# EAGLE schematic Schematic Spo2 (1) (EAGLE 9.6.2)
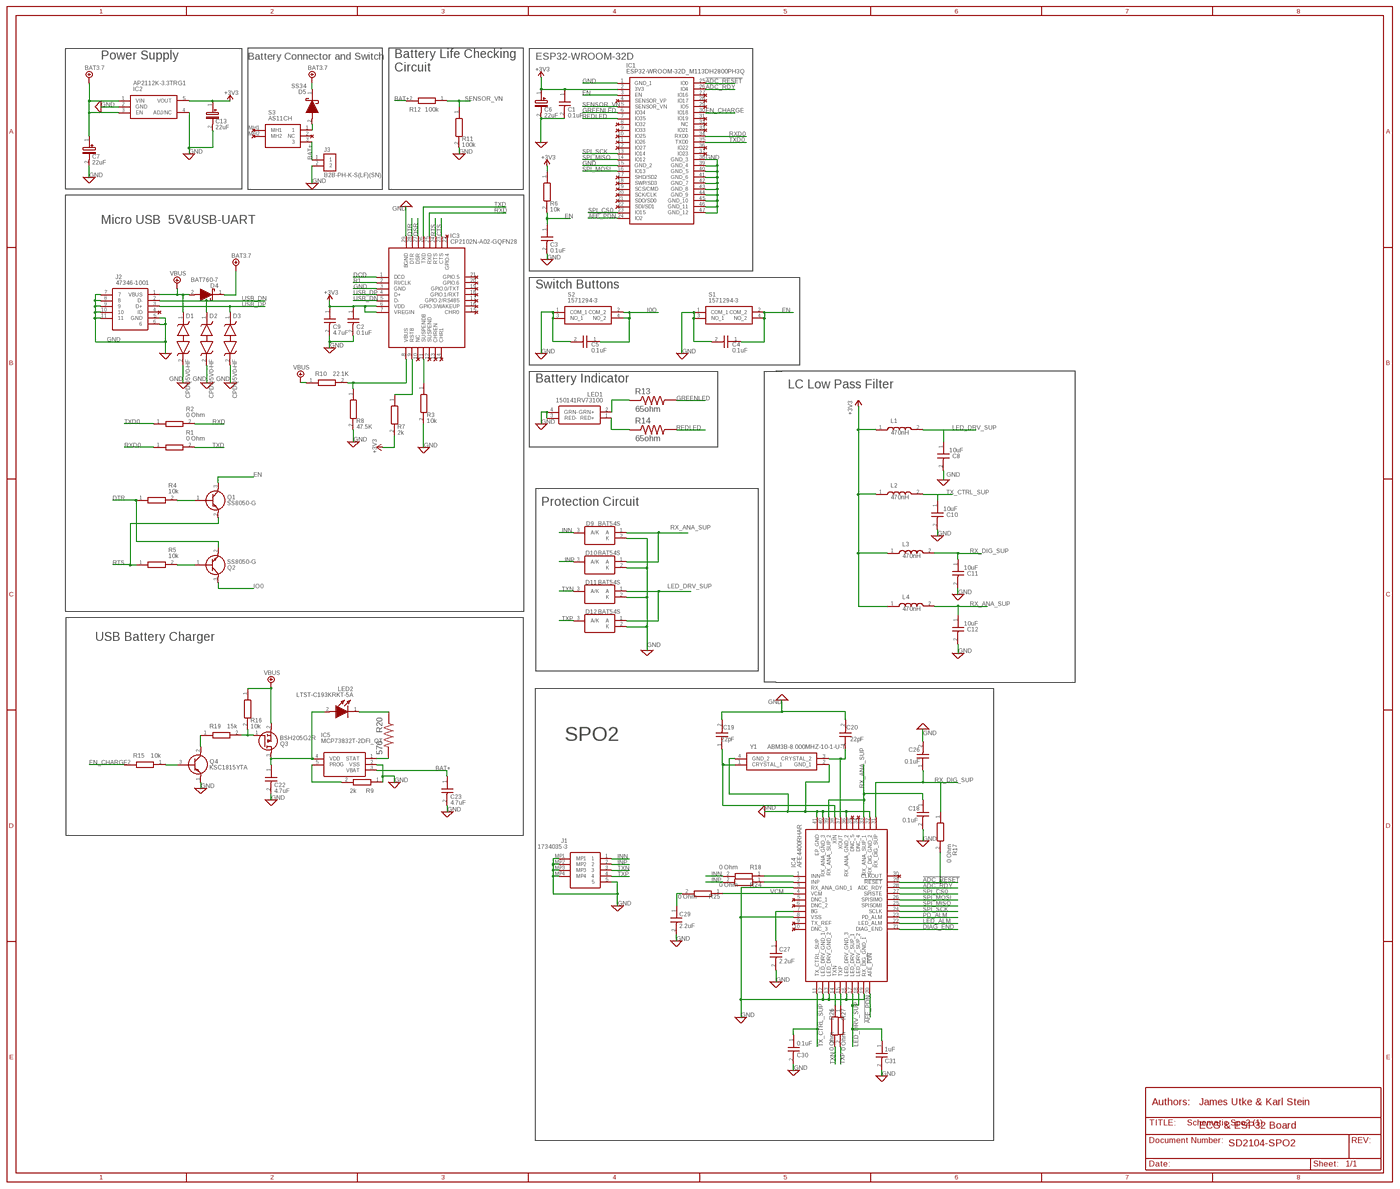
[diagram p0: schematic, sheet 1, overview]
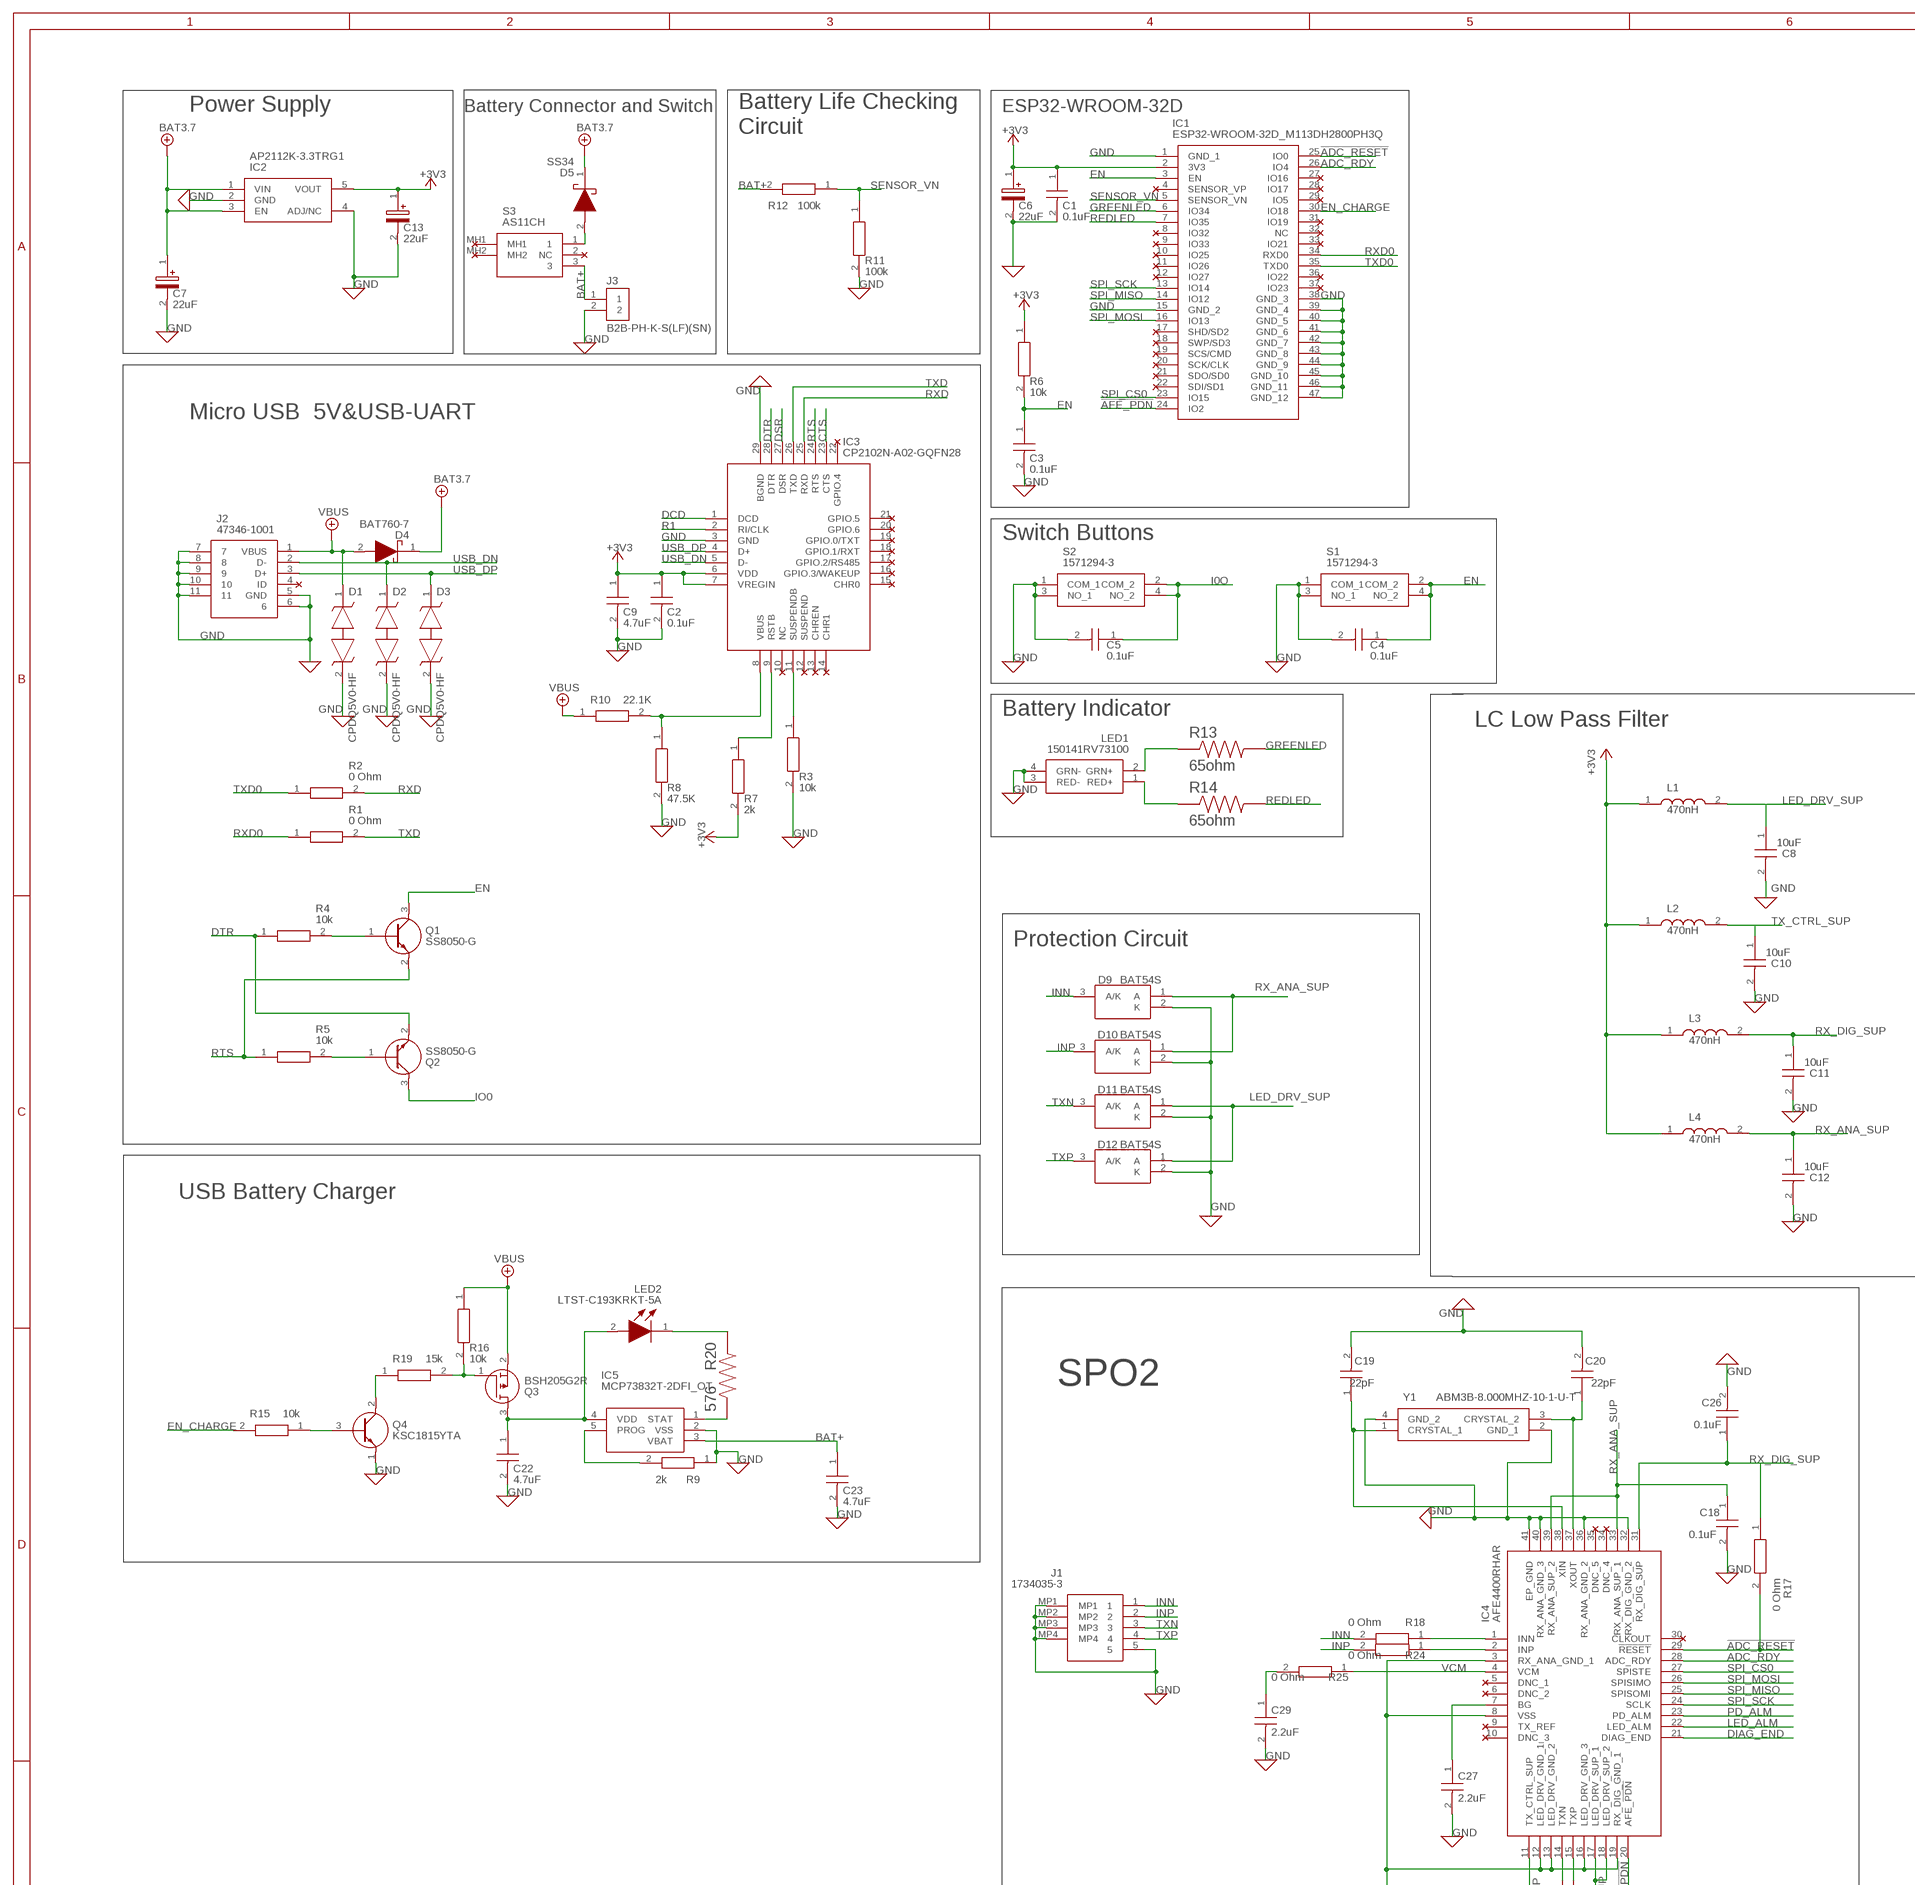
[diagram p1: schematic, sheet 1, part 1 of 4]
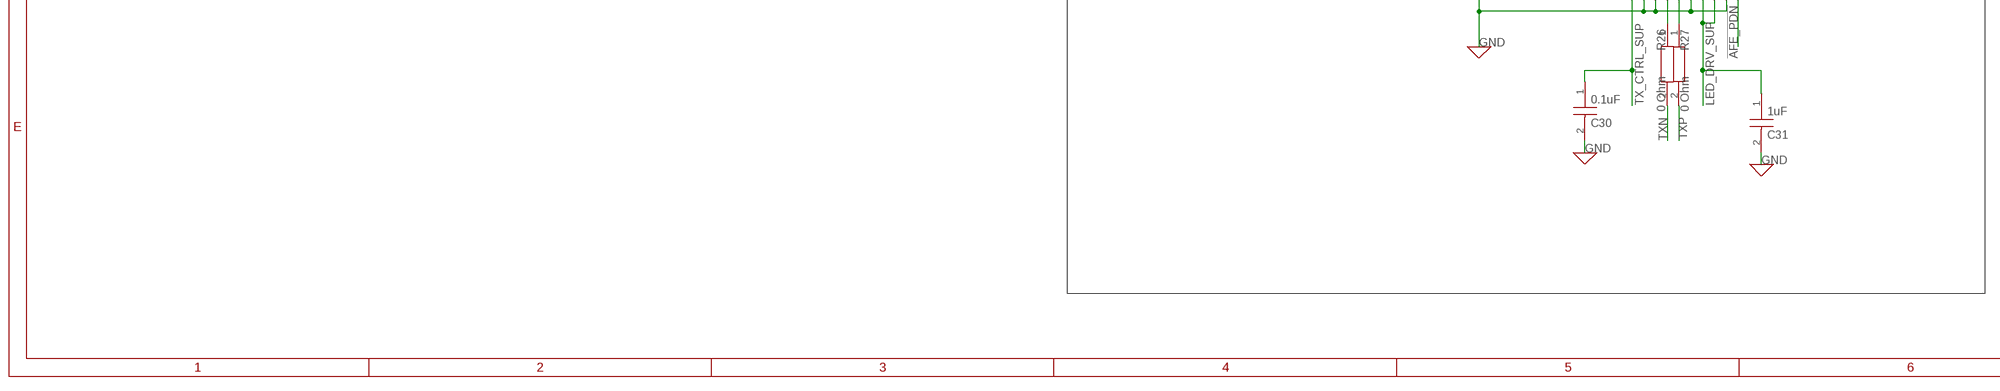
[diagram p2: schematic, sheet 1, part 2 of 4]
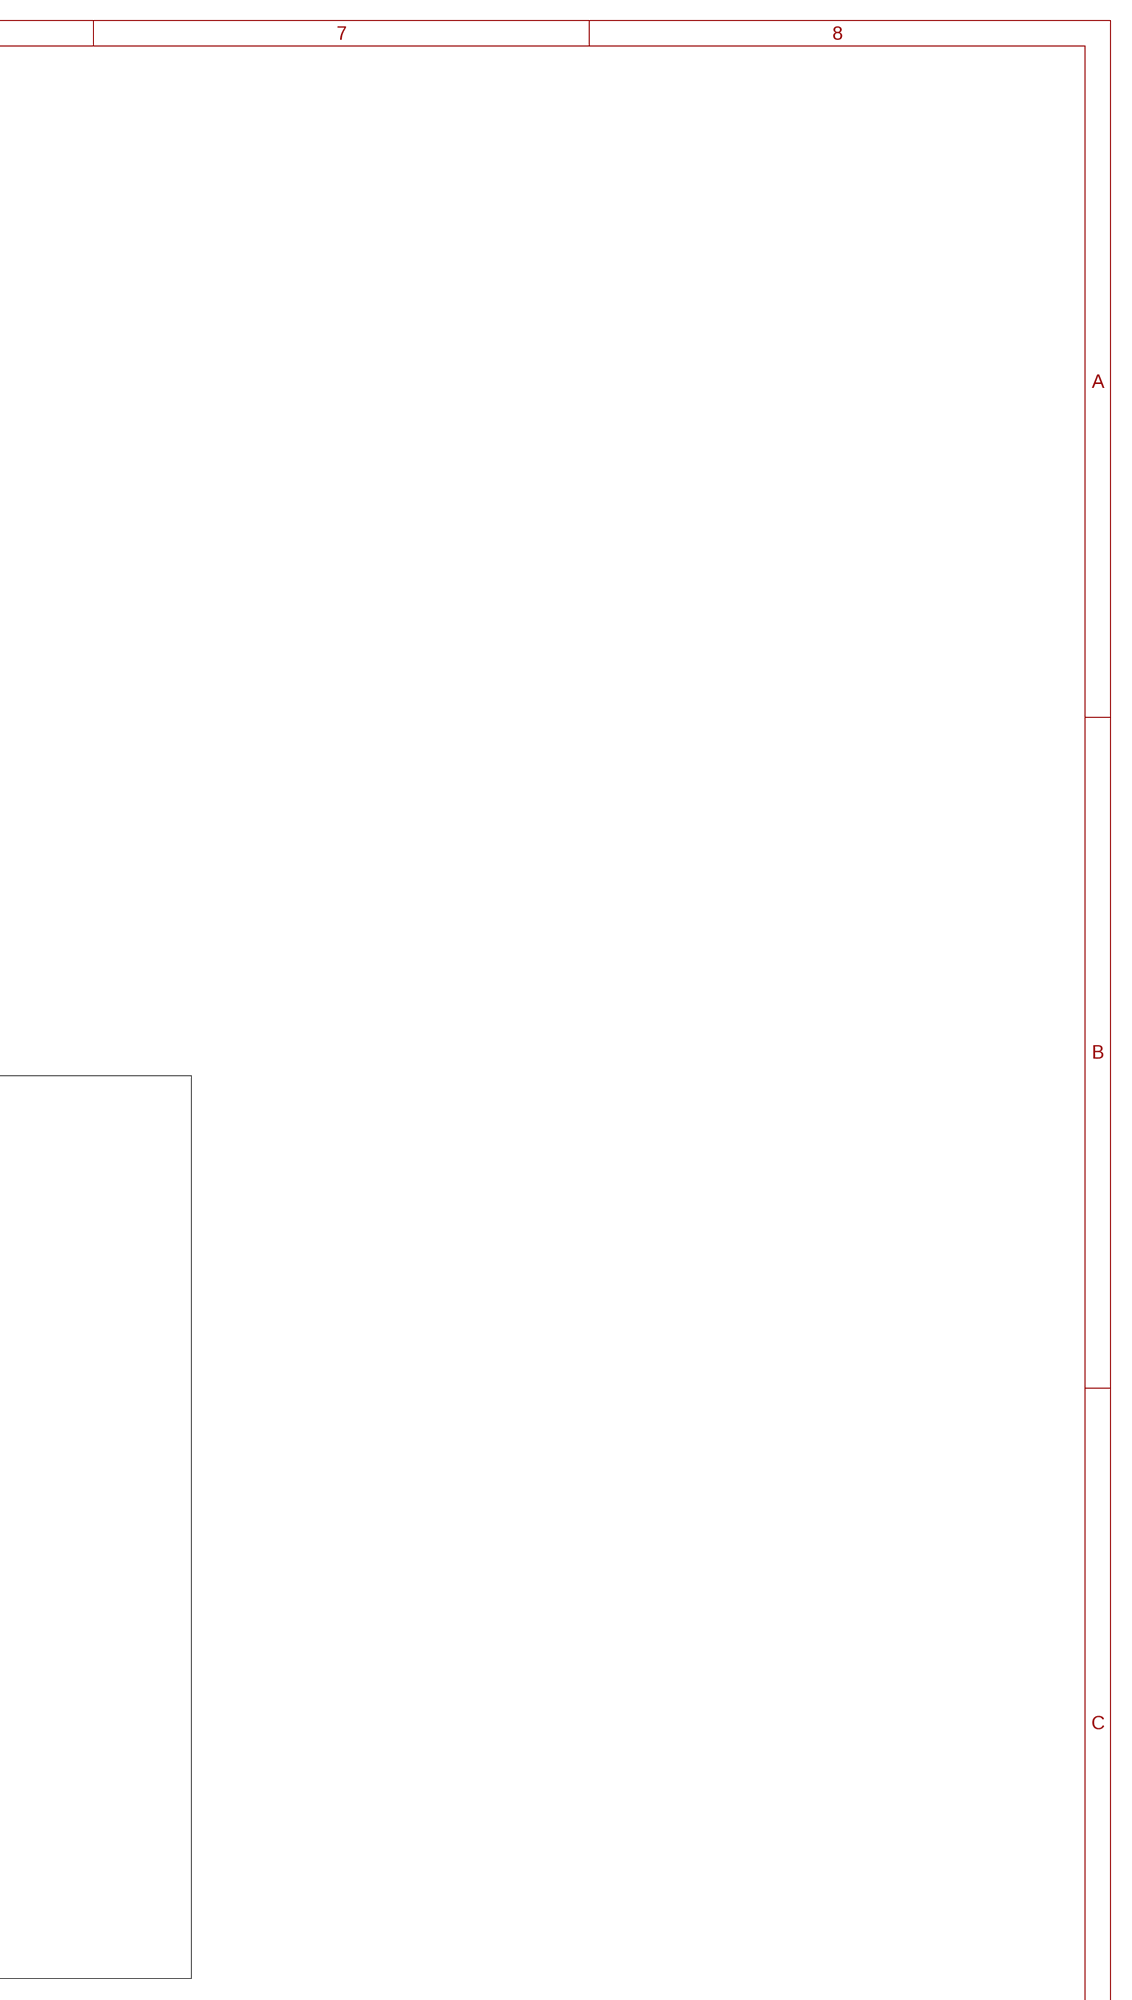
[diagram p3: schematic, sheet 1, part 3 of 4]
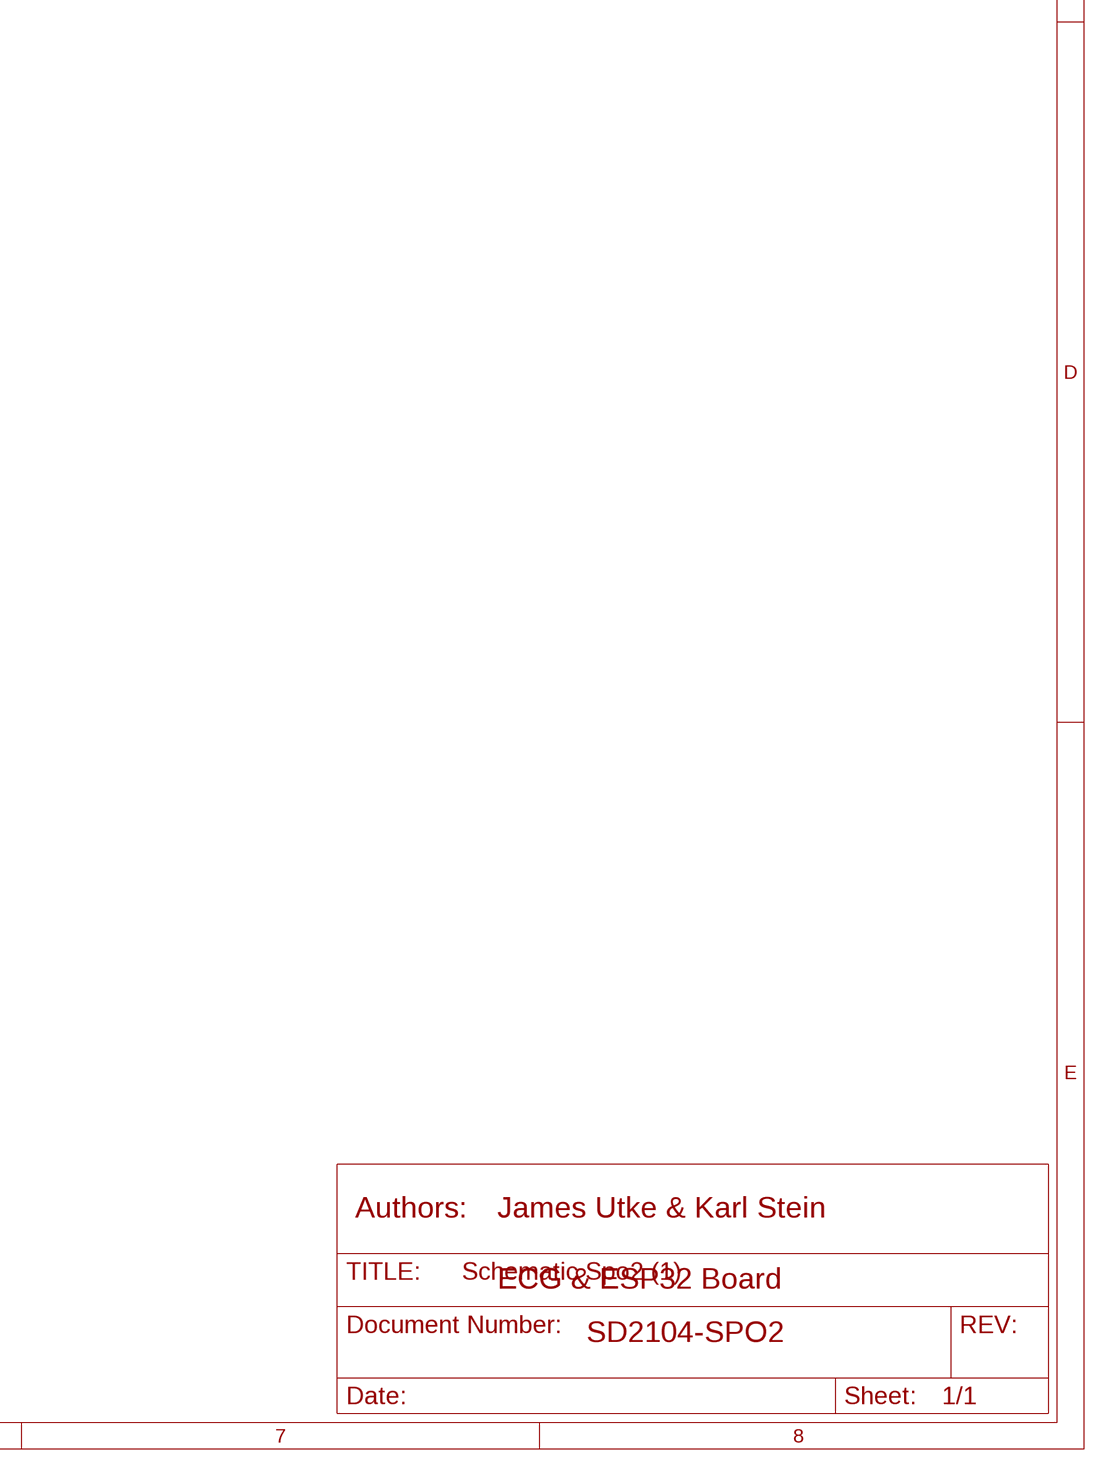
[diagram p4: schematic, sheet 1, part 4 of 4]

## Parts
C1  0.1uF  C0805C104K5RAC7411  [CAPC2012X88N]
C2  0.1uF  C0805C104K5RAC7411  [CAPC2012X88N]
C3  0.1uF  C0805C104K5RAC7411  [CAPC2012X88N]
C4  0.1uF  C0805C104K5RAC7411  [CAPC2012X88N]
C5  0.1uF  C0805C104K5RAC7411  [CAPC2012X88N]
C6  22uF  F381A226MMAAXE  [CAPPC1609X90N]
C7  22uF  F381A226MMAAXE  [CAPPC1609X90N]
C8  10uF  TMK212BC6106KG-T  [CAPC2114X145N@1]
C9  4.7uF  JMK212B7475KGHT  [CAPC2114X145N]
C10  10uF  TMK212BC6106KG-T  [CAPC2114X145N@1]
C11  10uF  TMK212BC6106KG-T  [CAPC2114X145N@1]
C12  10uF  TMK212BC6106KG-T  [CAPC2114X145N@1]
C13  22uF  F381A226MMAAXE  [CAPPC1609X90N]
C18  0.1uF  C0805C104K5RAC7411  [CAPC2012X88N]
C19  22pF  C0805C220K1HACTU  [CAPC2012X88N@1]
C20  22pF  C0805C220K1HACTU  [CAPC2012X88N@1]
C22  4.7uF  JMK212B7475KGHT  [CAPC2114X145N]
C23  4.7uF  JMK212B7475KGHT  [CAPC2114X145N]
C26  0.1uF  C0805C104K5RAC7411  [CAPC2012X88N]
C27  2.2uF  C1608X7S1C225K080AE  [CAPC1608X80N]
C29  2.2uF  C1608X7S1C225K080AE  [CAPC1608X80N]
C30  0.1uF  C0805C104K5RAC7411  [CAPC2012X88N]
C31  1uF  C0805X105K8RAC7210  [CAPC2012X100N]
D1  CPDQ5V0-HF  [SODFL1006X40N]
D2  CPDQ5V0-HF  [SODFL1006X40N]
D3  CPDQ5V0-HF  [SODFL1006X40N]
D4  BAT760-7  [SOD2513X120N]
D5  SS34  [DIOM8059X256N]
D9  BAT54S  [SOT95P240X110-3N]
D10  BAT54S  [SOT95P240X110-3N]
D11  BAT54S  [SOT95P240X110-3N]
D12  BAT54S  [SOT95P240X110-3N]
IC1  ESP32-WROOM-32D_M113DH2800PH3Q  [ESP32WROOM32DM113DH2800PH3Q0]
IC2  AP2112K-3.3TRG1  [SOT95P282X130-5N]
IC3  CP2102N-A02-GQFN28  [QFN50P500X500X80-29N]
IC4  AFE4400RHAR  [QFN50P600X600X100-41N]
IC5  MCP73832T-2DFI_OT  [SOT95P270X145-5N]
J1  1734035-3  [17340353]
J2  47346-1001  [473461001]
J3  B2B-PH-K-S(LF)(SN)  [JST_B2B-PH-K-S(LF)(SN)]
L1  470nH  LPS3010-471MRC  [LPS3010471MRC]
L2  470nH  LPS3010-471MRC  [LPS3010471MRC]
L3  470nH  LPS3010-471MRC  [LPS3010471MRC]
L4  470nH  LPS3010-471MRC  [LPS3010471MRC]
LED1  150141RV73100  [SMD3528_1]
LED2  LTST-C193KRKT-5A  [LEDC1608X45N]
Q1  SS8050-G  [SOT95P240X115-3N]
Q2  SS8050-G  [SOT95P240X115-3N]
Q3  BSH205G2R  [SOT95P230X110-3N]
Q4  KSC1815YTA  [BC33740TA]
R1  0 Ohm  CR0603AJ_-000ELF  [RESC1608X55N]
R2  0 Ohm  CR0603AJ_-000ELF  [RESC1608X55N]
R3  10k  HV73V1JTTD103J  [CAPC1608X55N]
R4  10k  HV73V1JTTD103J  [CAPC1608X55N]
R5  10k  HV73V1JTTD103J  [CAPC1608X55N]
R6  10k  HV73V1JTTD103J  [CAPC1608X55N]
R7  2k  ERJ-UP3F2001V  [RESC1608X55N]
R8  47.5K  ERJ-UP3F4752V  [RESC1608X55N]
R9  2k  ERJ-UP3F2001V  [RESC1608X55N]
R10  22.1K  ERJ-2RHD2212X  [RESC1005X40N]
R11  100k  RCG0603100KJNEA  [RESC1608X50N]
R12  100k  RCG0603100KJNEA  [RESC1608X50N]
R13  65ohm  Y402265R0000A9W  [RESC2012X64N]
R14  65ohm  Y402265R0000A9W  [RESC2012X64N]
R15  10k  HV73V1JTTD103J  [CAPC1608X55N]
R16  10k  HV73V1JTTD103J  [CAPC1608X55N]
R17  0 Ohm  CR0603AJ_-000ELF  [RESC1608X55N]
R18  0 Ohm  CR0603AJ_-000ELF  [RESC1608X55N]
R19  15k  CRCW080515K0FKEBC  [RESC2012X60N]
R20  576  CRCW0805576RFKEA  [RESC2012X50N]
R24  0 Ohm  CR0603AJ_-000ELF  [RESC1608X55N]
R25  0 Ohm  CR0603AJ_-000ELF  [RESC1608X55N]
R26  0 Ohm  CR0603AJ_-000ELF  [RESC1608X55N]
R27  0 Ohm  CR0603AJ_-000ELF  [RESC1608X55N]
S1  1571294-3  [15712943]
S2  1571294-3  [15712943]
S3  AS11CH  [AS11CH]
Y1  ABM3B-8.000MHZ-10-1-U-T  [ABM3B]

## Nets
0: C1.2 C6.2(-) ; supply symbol labelled GND
!ADC_RESET: IC1.25(IO0) IC4.29(!RESET) R17.2
!AFE_PDN: IC1.24(IO2) IC4.20(AFE_!PDN)
+3V3: C1.1 C2.1 C6.1(+) C9.1 C13.1(+) IC1.2(3V3) IC2.5(VOUT) IC3.6(VDD) IC3.7(VREGIN) L1.1 L2.1 L3.1 L4.1 R6.1 R7.2
+5V: C7.1(+) D4.1(K) D5.1(K) IC2.1(VIN) IC2.3(EN) ; supply symbol labelled BAT3.7
+5V/1: D1.1 D4.2(A) J2.1(VBUS) Q3.2(S) R10.1 R16.1 ; supply symbol labelled VBUS
ADC_RDY: IC1.26(IO4) IC4.28(ADC_RDY)
BAT+: C23.1 IC5.3(VBAT) J3.1 R12.2 S3.3
CTS: IC3.23(CTS)
DCD: IC3.1(DCD)
DIAG_END: IC4.21(DIAG_END)
DSR: IC3.27(DSR)
DTR: IC3.28(DTR) Q2.2(E) R4.1
EN: C3.1 C4.1 IC1.3(EN) Q1.3(C) R6.2 S1.2(COM_2) S1.4(NO_2)
EN_CHARGE: IC1.30(IO18) R15.2
GND: C2.2 C3.2 C4.2 C5.2 C7.2(-) C8.2 C9.2 C10.2 C11.2 C12.2 C13.2(-) C18.2 C19.2 C20.2 C22.2 C23.2 C26.2 C27.2 C29.2 C30.2 C31.2 D1.2 D2.2 D3.2 D9.2(K) D10.2(K) D11.2(K) D12.2(K) IC1.1(GND_1) IC1.15(GND_2) IC1.38(GND_3) IC1.39(GND_4) IC1.40(GND_5) IC1.41(GND_6) IC1.42(GND_7) IC1.43(GND_8) IC1.44(GND_9) IC1.45(GND_10) IC1.46(GND_11) IC1.47(GND_12) IC2.2(GND) IC2.4(ADJ/NC) IC3.3(GND) IC3.29(BGND) IC4.3(RX_ANA_GND_1) IC4.8(VSS) IC4.12(LED_DRV_GND_1) IC4.13(LED_DRV_GND_2) IC4.16(LED_DRV_GND_3) IC4.19(RX_DIG_GND_1) IC4.32(RX_DIG_GND_2) IC4.36(RX_ANA_GND_2) IC4.40(RX_ANA_GND_3) IC4.41(EP_GND) IC5.2(VSS) J1.5 J1.MP1 J1.MP2 J1.MP3 J1.MP4 J2.5(GND) J2.6 J2.7 J2.8 J2.9 J2.10 J2.11 J3.2 LED1.3(RED-) LED1.4(GRN-) Q4.1(E) R3.2 R8.2 R9.1 R11.2 S1.1(COM_1) S1.3(NO_1) S2.1(COM_1) S2.3(NO_1) Y1.2(GND_1) Y1.4(GND_2)
GREENLED: IC1.6(IO34) R13.2
I0O: C5.1 S2.2(COM_2) S2.4(NO_2)
INN: D9.3(A/K) J1.1 R18.2
INP: D10.3(A/K) J1.2 R24.2
IO0: Q2.3(C)
LED_ALM: IC4.22(LED_ALM)
LED_DRV_SUP: C8.1 C31.1 D11.1(A) D12.1(A) IC4.17(LED_DRV_SUP_1) IC4.18(LED_DRV_SUP_2) L1.2
N$1: LED1.2(GRN+) R13.1
N$2: LED1.1(RED+) R14.1
N$3: C19.1 IC4.38(XIN) Y1.1(CRYSTAL_1)
N$4: Q1.1(B) R4.2
N$5: Q2.1(B) R5.2
N$6: IC5.5(PROG) R9.2
N$7: C20.1 IC4.37(XOUT) Y1.3(CRYSTAL_2)
N$8: C27.1 IC4.7(BG)
N$9: IC4.1(INN) R18.1
N$10: IC4.2(INP) R24.1
N$11: IC4.14(TXN) R26.1
N$12: C29.1 R25.2
N$13: IC4.15(TXP) R27.1
N$14: Q4.3(B) R15.1
N$15: Q4.2(C) R19.1
N$16: IC3.11(SUSPENDB) R3.1
N$17: IC3.9(RSTB) R7.1
N$18: IC3.8(VBUS) R8.1 R10.2
N$19: LED2.1(K) R20.1
N$20: D5.2(A) S3.1
N$25: Q3.1(G) R16.2 R19.2
N$26: IC5.1(STAT) R20.2
N$28: C22.1 IC5.4(VDD) LED2.2(A) Q3.3(D)
PD_ALM: IC4.23(PD_ALM)
R1: IC3.2(RI/CLK)
REDLED: IC1.7(IO35) R14.2
RTS: IC3.24(RTS) Q1.2(E) R5.1
RX_ANA_SUP: C12.1 C18.1 D9.1(A) D10.1(A) IC4.33(RX_ANA_SUP_1) IC4.39(RX_ANA_SUP_2) L4.2
RX_DIG_SUP: C11.1 C26.1 IC4.31(RX_DIG_SUP) L3.2 R17.1
RXD: IC3.25(RXD) R2.2
RXD0: IC1.34(RXD0) R1.1
SENSOR_VN: IC1.5(SENSOR_VN) R11.1 R12.1
SPI_CS0: IC1.23(IO15) IC4.27(SPISTE)
SPI_MISO: IC1.14(IO12) IC4.25(SPISOMI)
SPI_MOSI: IC1.16(IO13) IC4.26(SPISIMO)
SPI_SCK: IC1.13(IO14) IC4.24(SCLK)
TX_CTRL_SUP: C10.1 C30.1 IC4.11(TX_CTRL_SUP) L2.2
TXD: IC3.26(TXD) R1.2
TXD0: IC1.35(TXD0) R2.1
TXN: D11.3(A/K) J1.3 R26.2
TXP: D12.3(A/K) J1.4 R27.2
USB_DN: D2.1 IC3.5(D-) J2.2(D-)
USB_DP: D3.1 IC3.4(D+) J2.3(D+)
VCM: IC4.4(VCM) R25.1
Unconnected: IC1.4(SENSOR_VP) IC1.8(IO32) IC1.9(IO33) IC1.10(IO25) IC1.11(IO26) IC1.12(IO27) IC1.17(SHD/SD2) IC1.18(SWP/SD3) IC1.19(SCS/CMD) IC1.20(SCK/CLK) IC1.21(SDO/SD0) IC1.22(SDI/SD1) IC1.27(IO16) IC1.28(IO17) IC1.29(IO5) IC1.31(IO19) IC1.32(NC) IC1.33(IO21) IC1.36(IO22) IC1.37(IO23) IC3.10(NC) IC3.12(SUSPEND) IC3.13(CHREN) IC3.14(CHR1) IC3.15(CHR0) IC3.16(GPIO.3/WAKEUP) IC3.17(GPIO.2/RS485) IC3.18(GPIO.1/RXT) IC3.19(GPIO.0/TXT) IC3.20(GPIO.6) IC3.21(GPIO.5) IC3.22(GPIO.4) IC4.5(DNC_1) IC4.6(DNC_2) IC4.9(TX_REF) IC4.10(DNC_3) IC4.30(CLKOUT) IC4.34(DNC_4) IC4.35(DNC_5) J2.4(ID) S3.2(NC) S3.MH1 S3.MH2

## Notes on the sheet
- Power Supply | Battery Connector and Switch | ESP32-WROOM-32D
- Battery Life Checking 
  Circuit
- Micro USB  5V&USB-UART
- Switch Buttons
- Battery Indicator
- LC Low Pass Filter
- Protection Circuit
- USB Battery Charger
- SPO2
- Authors: | James Utke & Karl Stein
- ECG & ESP32 Board
- SD2104-SPO2

## Library data of the parts
C1-C5 C18 C26 C30 = SamacSys_Parts:C0805C104K5RAC7411: Cap Ceramic 0.1uF 50V X7R 10% Pad SMD 0805 125C T/R Source: Datasheet; DESCRIPTION: Cap Ceramic 0.1uF 50V X7R 10% Pad SMD 0805 125C T/R; HEIGHT: 0.88mm; MANUFACTURER_NAME: Kemet; MANUFACTURER_PART_NUMBER: C0805C104K5RAC7411; MOUSER_PART_NUMBER: 80-C0805C104K5RACLR; MOUSER_PRICE-STOCK: https://www.mouser.co.uk/ProductDetail/KEMET/C0805C104K5RAC7411/?qs=jbRM9o5BbzPcVXF0wW9AYg%3D%3D
C6 C7 C13 = SamacSys_Parts:F381A226MMAAXE: 22uF F38 Series Conductive Polymer, Miniature, Undertab Solid Electrolytic Chip Capacitors Source: Datasheet <https://componentsearchengine.com/Datasheets/1/F381A226MMAAXE.pdf>; DESCRIPTION: 22uF F38 Series Conductive Polymer, Miniature, Undertab Solid Electrolytic Chip Capacitors; HEIGHT: 0.9mm; MANUFACTURER_NAME: AVX; MANUFACTURER_PART_NUMBER: F381A226MMAAXE; MOUSER_PART_NUMBER: 581-F381A226MMAAXE; MOUSER_PRICE-STOCK: https://www.mouser.co.uk/ProductDetail/AVX/F381A226MMAAXE?qs=gTYE2QTfZfQFi8JvXKXiKg%3D%3D
C8 C10-C12 = SamacSys_Parts:TMK212BC6106KG-T: Status Mass Production (Preferred) Capacitance 10 uF +/- 10 % Case Size (EIA/JIS) 0805/2012 Rated Voltage 25 V tan (max) 10 % Temperature Characteristic (EIA) X6S Operating Temp. Range (EIA) -55 to +105 High Temperature Loading (% Rated Voltage) 150 % Insulation Resistance (min) 100 MuF Dimension L 2.0 +0.20/-0.00 mm Dimension W 1.25 +0.20/-0.00 mm Dimension T 1.25 +0.20/-0.00 mm Dimension e 0.50 +/-0.25 mm RoHS Compliance (10 subst.) Yes REACH Compliance (205 subst.) Yes IEC62474 (Ver. D19 Source: Datasheet <https://ds.yuden.co.jp/TYCOMPAS/ut/download?pn=LMK063BBJ474MPLF&fileType=CA>; DESCRIPTION: Status Mass Production (Preferred) Capacitance 10 uF +/- 10 % Case Size (EIA/JIS) 0805/2012 Rated Voltage 25 V tan (max) 10 % Temperature Characteristic (EIA) X6S Operating Temp. Range (EIA) -55 to +105 High Temperature Loading (% Rated Voltage) 150 % Insulation Resistance (min) 100 MuF Dimension L 2.0 +0.20/-0.00 mm Dimension W 1.25 +0.20/-0.00 mm Dimension T 1.25 +0.20/-0.00 mm Dimension e 0.50 +/-0.25 mm RoHS Compliance (10 subst.) Yes REACH Compliance (205 subst.) Yes IEC62474 (Ver. D19; HEIGHT: 1.45mm; MANUFACTURER_NAME: TAIYO YUDEN; MANUFACTURER_PART_NUMBER: TMK212BC6106KG-T; MOUSER_PART_NUMBER: 963-TMK212BC6106KG-T; MOUSER_PRICE-STOCK: https://www.mouser.co.uk/ProductDetail/Taiyo-Yuden/TMK212BC6106KG-T/?qs=rI7uf1IzohRW7kV5WJ6mlg%3D%3D
C9 C22 C23 = SamacSys_Parts:JMK212B7475KGHT: Taiyo Yuden JMK212B7475KGHT 4.7F MLCC 6.3V dc +/-10% Tolerance SMD Source: Datasheet; DESCRIPTION: Taiyo Yuden JMK212B7475KGHT 4.7F MLCC 6.3V dc +/-10% Tolerance SMD; HEIGHT: 1.45mm; MANUFACTURER_NAME: TAIYO YUDEN; MANUFACTURER_PART_NUMBER: JMK212B7475KGHT; MOUSER_PART_NUMBER: 963-JMK212B7475KGHT; MOUSER_PRICE-STOCK: https://www.mouser.co.uk/ProductDetail/Taiyo-Yuden/JMK212B7475KGHT/?qs=vmHwEFxEFR9NgetR%2FORAvw%3D%3D
C19 C20 = SamacSys_Parts:C0805C220K1HACTU: Multilayer Ceramic Capacitors MLCC - SMD/SMT 100V 22pF X8R 0805 10% Source: Datasheet; DESCRIPTION: Multilayer Ceramic Capacitors MLCC - SMD/SMT 100V 22pF X8R 0805 10%; HEIGHT: 0.88mm; MANUFACTURER_NAME: Kemet; MANUFACTURER_PART_NUMBER: C0805C220K1HACTU; MOUSER_PART_NUMBER: 80-C0805C220K1HACTU; MOUSER_PRICE-STOCK: https://www.mouser.co.uk/ProductDetail/KEMET/C0805C220K1HACTU/?qs=W0yvOO0ixfHaPTgNXyVDyQ%3D%3D
C27 C29 = SamacSys_Parts:C1608X7S1C225K080AE: Multilayer Ceramic Capacitors MLCC - SMD/SMT 0603 16VDC 2.2uF 10% X7S Source: Datasheet <https://product.tdk.com/info/en/catalog/datasheets/mlcc_commercial_midvoltage_en.pdf>; DESCRIPTION: Multilayer Ceramic Capacitors MLCC - SMD/SMT 0603 16VDC 2.2uF 10% X7S; HEIGHT: 0.8mm; MANUFACTURER_NAME: TDK; MANUFACTURER_PART_NUMBER: C1608X7S1C225K080AE; MOUSER_PART_NUMBER: 810-C1608X7S1C225K08; MOUSER_PRICE-STOCK: https://www.mouser.co.uk/ProductDetail/TDK/C1608X7S1C225K080AE/?qs=zW32dvEIR3tqedNHz865EA%3D%3D
C31 = SamacSys_Parts:C0805X105K8RAC7210: Multilayer Ceramic Capacitors MLCC - SMD/SMT 10V 1uF X7R 0805 10% Flex Source: Datasheet; DESCRIPTION: Multilayer Ceramic Capacitors MLCC - SMD/SMT 10V 1uF X7R 0805 10% Flex; HEIGHT: 1mm; MANUFACTURER_NAME: Kemet; MANUFACTURER_PART_NUMBER: C0805X105K8RAC7210; MOUSER_PART_NUMBER: 80-C0805X105K8RACLR; MOUSER_PRICE-STOCK: https://www.mouser.co.uk/ProductDetail/KEMET/C0805X105K8RAC7210?qs=ds50AKTGxA8Ac4j4qbsB5A%3D%3D
D1-D3 = SamacSys_Parts:CPDQ5V0-HF: ESD Suppressors / TVS Diodes SMD ESD Diode 5V Bi-Direction Source: Datasheet <http://www.comchiptech.com/cms/UserFiles/CPDQ5V0-HF RevA825126.pdf>; DESCRIPTION: ESD Suppressors / TVS Diodes SMD ESD Diode 5V Bi-Direction; HEIGHT: 0.4mm; MANUFACTURER_NAME: Comchip Technology; MANUFACTURER_PART_NUMBER: CPDQ5V0-HF; MOUSER_PART_NUMBER: 750-CPDQ5V0-HF; MOUSER_PRICE-STOCK: https://www.mouser.co.uk/ProductDetail/Comchip-Technology/CPDQ5V0-HF/?qs=ccyN4P6STah119k8k5VB0Q%3D%3D
D4 = SamacSys_Parts:BAT760-7: Diode Schottky 30V 1A 2Pin SOD323 Diodes Inc BAT760-7, SMT Schottky Diode, 30V 1A, 2-Pin SOD-323 Source: Datasheet <https://www.diodes.com/assets/Datasheets/ds30498.pdf>; DESCRIPTION: Diode Schottky 30V 1A 2Pin SOD323 Diodes Inc BAT760-7, SMT Schottky Diode, 30V 1A, 2-Pin SOD-323; HEIGHT: 1.2mm; MANUFACTURER_NAME: Diodes Inc.; MANUFACTURER_PART_NUMBER: BAT760-7; MOUSER_PART_NUMBER: 621-BAT760-7; MOUSER_PRICE-STOCK: https://www.mouser.co.uk/ProductDetail/Diodes-Incorporated/BAT760-7?qs=JV7lzlMm3yKDDyO09xoRbQ%3D%3D
D5 = SamacSys_Parts:SS34: ON Semi SS34 SMT Schottky Diode, 40V 3A, 2-Pin DO-214AB Source: Datasheet <https://componentsearchengine.com/Datasheets/2/SS34.pdf>; DESCRIPTION: ON Semi SS34 SMT Schottky Diode, 40V 3A, 2-Pin DO-214AB; HEIGHT: 2.56mm; MANUFACTURER_NAME: ON Semiconductor; MANUFACTURER_PART_NUMBER: SS34; MOUSER_PART_NUMBER: 512-SS34; MOUSER_PRICE-STOCK: https://www.mouser.co.uk/ProductDetail/ON-Semiconductor-Fairchild/SS34?qs=2ONuHmP%2FXzb3ub11UdFfdQ%3D%3D
D9-D12 = SamacSys_Parts:BAT54S: Schottky Diodes & Rectifiers SOT23 0.2A 30V Schot tky Dblr Source: Datasheet <https://www.rectron.com/data_sheets/bat54s.pdf>; DESCRIPTION: Schottky Diodes & Rectifiers SOT23 0.2A 30V Schot tky Dblr; HEIGHT: 1.1mm; MANUFACTURER_NAME: Rectron; MANUFACTURER_PART_NUMBER: BAT54S; MOUSER_PART_NUMBER: 583-BAT54S; MOUSER_PRICE-STOCK: https://www.mouser.co.uk/ProductDetail/Rectron/BAT54S/?qs=7pEAo90IqNGRiqD7TkybWA%3D%3D
IC1 = SamacSys_Parts:ESP32-WROOM-32D_M113DH2800PH3Q: WiFi Modules (802.11) SMD Module, ESP32-D0WD, 32Mbits SPI flash, UART mode, PCB antenna Source: Datasheet <https://www.espressif.com/sites/default/files/documentation/esp32-wroom-32d_esp32-wroom-32u_datasheet_en.pdf>; DESCRIPTION: WiFi Modules (802.11) SMD Module, ESP32-D0WD, 32Mbits SPI flash, UART mode, PCB antenna; HEIGHT: 3.2mm; MANUFACTURER_NAME: Espressif Systems; MANUFACTURER_PART_NUMBER: ESP32-WROOM-32D(M113DH2800PH3Q0); MOUSER_PART_NUMBER: 356-ES32WROOM32D16MB; MOUSER_PRICE-STOCK: https://www.mouser.co.uk/ProductDetail/Espressif-Systems/ESP32-WROOM-32DM113DH2800PH3Q0/?qs=W%2FMpXkg%252BdQ75%2Fda1rSxxJw%3D%3D
IC2 = SamacSys_Parts:AP2112K-3.3TRG1: 600mA 3.3V LDO Regulator Enable SOT23-5 DiodesZetex AP2112K-3.3TRG1, LDO Voltage Regulator, 3.3 V +/-1.5%, 2.5 6 Vin, 5-Pin SOT-23 Source: Datasheet; DESCRIPTION: 600mA 3.3V LDO Regulator Enable SOT23-5 DiodesZetex AP2112K-3.3TRG1, LDO Voltage Regulator, 3.3 V +/-1.5%, 2.5 6 Vin, 5-Pin SOT-23; HEIGHT: 1.3mm; MANUFACTURER_NAME: Diodes Inc.; MANUFACTURER_PART_NUMBER: AP2112K-3.3TRG1; MOUSER_PART_NUMBER: 621-AP2112K-3.3TRG1; MOUSER_PRICE-STOCK: https://www.mouser.co.uk/ProductDetail/Diodes-Incorporated/AP2112K-33TRG1/?qs=x6A8l6qLYDDPYHosCdzh%2FA%3D%3D
IC3 = SamacSys_Parts:CP2102N-A02-GQFN28: SILICON LABS - CP2102N-A02-GQFN28 - USB TO UART BRIDGE, -40 TO 85DEG C Source: Datasheet <https://componentsearchengine.com/Datasheets/2/CP2102N-A02-GQFN28.pdf>; DESCRIPTION: SILICON LABS - CP2102N-A02-GQFN28 - USB TO UART BRIDGE, -40 TO 85DEG C; HEIGHT: 0.8mm; MANUFACTURER_NAME: Silicon Labs; MANUFACTURER_PART_NUMBER: CP2102N-A02-GQFN28; MOUSER_PART_NUMBER: 634-CP2102NA02GQFN28; MOUSER_PRICE-STOCK: https://www.mouser.co.uk/ProductDetail/Silicon-Labs/CP2102N-A02-GQFN28/?qs=u16ybLDytRaSBkSkyjYFiA%3D%3D
IC4 = SamacSys_Parts:AFE4400RHAR: Integrated Analog Front End (AFE) for Heart-Rate Monitors and Low-Cost Pulse Oximeters Source: Datasheet <http://www.ti.com/lit/ds/symlink/afe4400.pdf>; DESCRIPTION: Integrated Analog Front End (AFE) for Heart-Rate Monitors and Low-Cost Pulse Oximeters; HEIGHT: 1mm; MANUFACTURER_NAME: Texas Instruments; MANUFACTURER_PART_NUMBER: AFE4400RHAR; MOUSER_PART_NUMBER: 595-AFE4400RHAR; MOUSER_PRICE-STOCK: https://www.mouser.co.uk/ProductDetail/Texas-Instruments/AFE4400RHAR/?qs=MURVExHfc2zl%2FM9SqCv0pw%3D%3D
IC5 = SamacSys_Parts:MCP73832T-2DFI_OT: Battery Management 4.2V Li-Ion/Li-Poly Chrg mgnt controller Source: Datasheet <http://ww1.microchip.com/downloads/en/DeviceDoc/20001984g.pdf>; DESCRIPTION: Battery Management 4.2V Li-Ion/Li-Poly Chrg mgnt controller; HEIGHT: 1.45mm; MANUFACTURER_NAME: Microchip; MANUFACTURER_PART_NUMBER: MCP73832T-2DFI/OT; MOUSER_PART_NUMBER: 579-MCP73832T2DFI/OT; MOUSER_PRICE-STOCK: https://www.mouser.co.uk/ProductDetail/Microchip-Technology/MCP73832T-2DFI-OT?qs=Of9BA0M78V%2Fd7MaXZyVc5w%3D%3D
J1 = SamacSys_Parts:1734035-3: USB Connectors Mini R/A SMT B Type Source: Datasheet <https://www.te.com/commerce/DocumentDelivery/DDEController?Action=showdoc&DocId=Customer Drawing1734035FpdfEnglishENG_CD_1734035_F.pdf1734035-3>; DESCRIPTION: USB Connectors Mini R/A SMT B Type; HEIGHT: 3.95mm; MANUFACTURER_NAME: TE Connectivity; MANUFACTURER_PART_NUMBER: 1734035-3; MOUSER_PART_NUMBER: 571-1734035-3; MOUSER_PRICE-STOCK: https://www.mouser.co.uk/ProductDetail/TE-Connectivity/1734035-3?qs=JQ0T48ZyHbB%2Fl8a%2FPKP6Xw%3D%3D
J2 = SamacSys_Parts:47346-1001: MOLEX - 47346-1001 - MULTIPOLE CONNECTOR Source: Datasheet <http://www.molex.com/webdocs/datasheets/pdf/en-us/0473461001_IO_CONNECTORS.pdf>; DESCRIPTION: MOLEX - 47346-1001 - MULTIPOLE CONNECTOR; HEIGHT: 2.94mm; MANUFACTURER_NAME: Molex; MANUFACTURER_PART_NUMBER: 47346-1001; MOUSER_PART_NUMBER: 538-47346-1001; MOUSER_PRICE-STOCK: https://www.mouser.co.uk/ProductDetail/Molex/47346-1001/?qs=yd8XiKYcH9muPqUKe4E0Dw%3D%3D
J3 = B2B-PH-K-S_LF__SN_:B2B-PH-K-S(LF)(SN): PH Series 2 Position 2 mm Pitch Through Hole Top Entry Shrouded Header; DESCRIPTION: Connector Header Through Hole 2 position 0.079 (2.00mm); DIGI-KEY_PART_NUMBER: 455-1704-ND; MF: JST Sales; MP: B2B-PH-K-S(LF)(SN); PACKAGE: None; PURCHASE-URL: https://pricing.snapeda.com/search/part/B2B-PH-K-S(LF)(SN)/?ref=eda
L1-L4 = SamacSys_Parts:LPS3010-471MRC: Fixed Inductors 470nH Shld 1.8A 70 mOhms AECQ2 Source: Datasheet; DESCRIPTION: Fixed Inductors 470nH Shld 1.8A 70 mOhms AECQ2; HEIGHT: 1mm; MANUFACTURER_NAME: COILCRAFT; MANUFACTURER_PART_NUMBER: LPS3010-471MRC
LED1 = SamacSys_Parts:150141RV73100: LED,Wurth Elektronik,150141RV73100 Wurth Elektronik 150141RV73100, WL-SBTW Series Bi-colour Green, Red LED, 572 / 625 nm 4-Pin 3528 (1411), Round Lens Source: Datasheet <https://componentsearchengine.com/Datasheets/2/150141RV73100.pdf>; DESCRIPTION: LED,Wurth Elektronik,150141RV73100 Wurth Elektronik 150141RV73100, WL-SBTW Series Bi-colour Green, Red LED, 572 / 625 nm 4-Pin 3528 (1411), Round Lens; HEIGHT: mm; MANUFACTURER_NAME: Wurth Elektronik; MANUFACTURER_PART_NUMBER: 150141RV73100; MOUSER_PART_NUMBER: 710-150141RV73100; MOUSER_PRICE-STOCK: https://www.mouser.co.uk/ProductDetail/Wurth-Elektronik/150141RV73100?qs=LlUlMxKIyB1w9QlMugtMLA%3D%3D
LED2 = SamacSys_Parts:LTST-C193KRKT-5A: Lite-On LTST-C193KRKT-5A, 631 nm Red LED, 1608 (0603) SMD package Source: Datasheet; DESCRIPTION: Lite-On LTST-C193KRKT-5A, 631 nm Red LED, 1608 (0603) SMD package; HEIGHT: 0.45mm; MANUFACTURER_NAME: Lite-On; MANUFACTURER_PART_NUMBER: LTST-C193KRKT-5A; MOUSER_PART_NUMBER: 859-LTSTC193KRKT5A; MOUSER_PRICE-STOCK: https://www.mouser.co.uk/ProductDetail/Lite-On/LTST-C193KRKT-5A/?qs=xIkB7y1OTor17kZSHyF5tQ%3D%3D
Q1 Q2 = SamacSys_Parts:SS8050-G: Bipolar Transistors - BJT NPN TRANSISTOR 1.5A 40V Source: Datasheet <http://www.comchiptech.com/admin/files/product/SS8050-G RevA181526.pdf>; DESCRIPTION: Bipolar Transistors - BJT NPN TRANSISTOR 1.5A 40V; HEIGHT: 1.15mm; MANUFACTURER_NAME: Comchip Technology; MANUFACTURER_PART_NUMBER: SS8050-G; MOUSER_PART_NUMBER: 750-SS8050-G; MOUSER_PRICE-STOCK: https://www.mouser.co.uk/ProductDetail/Comchip-Technology/SS8050-G/?qs=LLUE9lz1YbcHg%252BWLMAtcrQ%3D%3D
Q3 = SamacSys_Parts:BSH205G2R: MOSFET 20V P-channel Trench MOSFET Source: Datasheet <https://assets.nexperia.com/documents/data-sheet/BSH205G2.pdf>; DESCRIPTION: MOSFET 20V P-channel Trench MOSFET; HEIGHT: 1.1mm; MANUFACTURER_NAME: Nexperia; MANUFACTURER_PART_NUMBER: BSH205G2R; MOUSER_PART_NUMBER: 771-BSH205G2R; MOUSER_PRICE-STOCK: https://www.mouser.co.uk/ProductDetail/Nexperia/BSH205G2R?qs=%252BRKXB2WKlScNIfK4SlBmFA%3D%3D
Q4 = SamacSys_Parts:KSC1815YTA: Transistor, Fairchild, KSC1815YTA Source: Datasheet <https://www.onsemi.com/products/discretes-drivers/general-purpose-and-low-vcesat-transistors/ksc1815>; DESCRIPTION: Transistor, Fairchild, KSC1815YTA; HEIGHT: mm; MANUFACTURER_NAME: ON Semiconductor; MANUFACTURER_PART_NUMBER: KSC1815YTA; MOUSER_PART_NUMBER: 512-KSC1815YTA; MOUSER_PRICE-STOCK: https://www.mouser.co.uk/ProductDetail/ON-Semiconductor-Fairchild/KSC1815YTA?qs=ljbEvF4DwOP9FJQWOCoFLQ%3D%3D
R1 R2 R17 R18 R24-R27 = SamacSys_Parts:CR0603AJ_-000ELF: Thick Film Resistors - SMD ResA 0603 0R Jumper 100mW AEC-Q200 Source: Datasheet; DESCRIPTION: Thick Film Resistors - SMD ResA 0603 0R Jumper 100mW AEC-Q200; HEIGHT: 0.55mm; MANUFACTURER_NAME: Bourns; MANUFACTURER_PART_NUMBER: CR0603AJ/-000ELF; MOUSER_PART_NUMBER: 652-CR0603AJ/-000ELF; MOUSER_PRICE-STOCK: https://www.mouser.co.uk/ProductDetail/Bourns/CR0603AJ-000ELF/?qs=GedFDFLaBXF8EepoWODZMQ%3D%3D
R3-R6 R15 R16 = SamacSys_Parts:HV73V1JTTD103J: Thick Film Resistors - SMD 10000Ohms 5% 0603 TCR=100 AEC-Q200 Source: Datasheet; DESCRIPTION: Thick Film Resistors - SMD 10000Ohms 5% 0603 TCR=100 AEC-Q200; HEIGHT: 0.55mm; MANUFACTURER_NAME: KOA Speer; MANUFACTURER_PART_NUMBER: HV73V1JTTD103J; MOUSER_PART_NUMBER: 660-HV73V1JTTD103J; MOUSER_PRICE-STOCK: https://www.mouser.co.uk/ProductDetail/KOA-Speer/HV73V1JTTD103J?qs=xZ%2FP%252Ba9zWqbXuiWLWua7%2Fw%3D%3D
R7 R9 = SamacSys_Parts:ERJ-UP3F2001V: Anti-Sulfurated Thick Film Chip Resistors / Anti-Surge Type Source: Datasheet <https://industrial.panasonic.com/cdbs/www-data/pdf/RDP0000/AOA0000C337.pdf>; DESCRIPTION: Anti-Sulfurated Thick Film Chip Resistors / Anti-Surge Type; HEIGHT: 0.55mm; MANUFACTURER_NAME: Panasonic; MANUFACTURER_PART_NUMBER: ERJ-UP3F2001V
R8 = SamacSys_Parts:ERJ-UP3F4752V: Thick Film Resistors - SMD AEC-Q200 Source: Datasheet; DESCRIPTION: Thick Film Resistors - SMD AEC-Q200; HEIGHT: 0.55mm; MANUFACTURER_NAME: Panasonic; MANUFACTURER_PART_NUMBER: ERJ-UP3F4752V; MOUSER_PART_NUMBER: 667-ERJ-UP3F4752V; MOUSER_PRICE-STOCK: https://www.mouser.co.uk/ProductDetail/Panasonic/ERJ-UP3F4752V?qs=GedFDFLaBXGUd1E4zR%252BF8g%3D%3D
R10 = SamacSys_Parts:ERJ-2RHD2212X: Thick Film Resistors - SMD 0402 Resistor 0.5% 50ppm 22.1KOhm Source: Datasheet; DESCRIPTION: Thick Film Resistors - SMD 0402 Resistor 0.5% 50ppm 22.1KOhm; HEIGHT: 0.4mm; MANUFACTURER_NAME: Panasonic; MANUFACTURER_PART_NUMBER: ERJ-2RHD2212X; MOUSER_PART_NUMBER: 667-ERJ-2RHD2212X; MOUSER_PRICE-STOCK: https://www.mouser.co.uk/ProductDetail/Panasonic/ERJ-2RHD2212X?qs=pfd5qewlna6lhy494ElLrw%3D%3D
R11 R12 = SamacSys_Parts:RCG0603100KJNEA: RCG0603100KJNEA Source: Datasheet <https://componentsearchengine.com/Datasheets/1/RCG0603100KJNEA.pdf>; DESCRIPTION: RCG0603100KJNEA; HEIGHT: 0.5mm; MANUFACTURER_NAME: Vishay; MANUFACTURER_PART_NUMBER: RCG0603100KJNEA; MOUSER_PART_NUMBER: 71-RCG0603100KJNEA; MOUSER_PRICE-STOCK: https://www.mouser.com/Search/Refine.aspx?Keyword=71-RCG0603100KJNEA
R13 R14 = Y402265R0000A9W:Y402265R0000A9W; DESCRIPTION: 65 Ohms ±0.05% 0.2W, 1/5W Chip Resistor 0805 (2012 Metric) Moisture Resistant, Non-Inductive Metal Foil; DIGI-KEY_PART_NUMBER: Y402265R0000A9W-ND; MF: Vishay; MP: Y402265R0000A9W; PACKAGE: 2012 Vishay
R19 = SamacSys_Parts:CRCW080515K0FKEBC: Thick Film Resistors - SMD 1/8Watt 15Kohms 1% Commercial Use Source: Datasheet <http://www.vishay.com/docs/28773/crcwce3.pdf>; DESCRIPTION: Thick Film Resistors - SMD 1/8Watt 15Kohms 1% Commercial Use; HEIGHT: 0.6mm; MANUFACTURER_NAME: Vishay; MANUFACTURER_PART_NUMBER: CRCW080515K0FKEBC; MOUSER_PART_NUMBER: 71-CRCW080515K0FKEBC; MOUSER_PRICE-STOCK: https://www.mouser.co.uk/ProductDetail/Vishay-Dale/CRCW080515K0FKEBC?qs=wd5RIQLrsJhoqkW23VWcpg%3D%3D
R20 = CRCW0805576RFKEA:CRCW0805576RFKEA: RES, THICK FILM, 576R, 1%, 0.125W, 0805; DESCRIPTION: 576 Ohms ±1% 0.125W, 1/8W Chip Resistor 0805 (2012 Metric) Automotive AEC-Q200 Thick Film; DIGI-KEY_PART_NUMBER: 541-576CCT-ND; MF: Vishay; MP: CRCW0805576RFKEA; PACKAGE: 2012 Vishay; PURCHASE-URL: https://pricing.snapeda.com/search/part/CRCW0805576RFKEA/?ref=eda
S1 S2 = SamacSys_Parts:1571294-3: SWITCH,TACT,SMT,SEALED Source: Datasheet <https://www.te.com/commerce/DocumentDelivery/DDEController?Action=srchrtrv&DocNm=1571294&DocType=Customer Drawing&DocLang=English&PartCntxt=1571294-3&DocFormat=pdf>; DESCRIPTION: SWITCH,TACT,SMT,SEALED; HEIGHT: 5.5mm; MANUFACTURER_NAME: TE Connectivity; MANUFACTURER_PART_NUMBER: 1571294-3; MOUSER_PART_NUMBER: 506-1571294-3; MOUSER_PRICE-STOCK: https://www.mouser.co.uk/ProductDetail/TE-Connectivity-PB/1571294-3/?qs=bkeGI61iuy0TyJA2A0%2FQXg%3D%3D
S3 = SamacSys_Parts:AS11CH: Switch Slide ON None OFF SPST Side Slide 0.1A 28VAC 28VDC 0.4VA 50000Cycles PC Pins Bracket Mount/Through Hole Source: Datasheet <https://componentsearchengine.com/Datasheets/1/AS11CH.pdf>; DESCRIPTION: Switch Slide ON None OFF SPST Side Slide 0.1A 28VAC 28VDC 0.4VA 50000Cycles PC Pins Bracket Mount/Through Hole; HEIGHT: 6.18mm; MANUFACTURER_NAME: NKK Switches; MANUFACTURER_PART_NUMBER: AS11CH; MOUSER_PART_NUMBER: 633-AS11CH; MOUSER_PRICE-STOCK: https://www.mouser.co.uk/ProductDetail/NKK-Switches/AS11CH?qs=MODAV37v1mC%2FcDng1K%2FMsg%3D%3D
Y1 = SamacSys_Parts:ABM3B-8.000MHZ-10-1-U-T: Abracon 8MHz Crystal +/-10ppm 4-SMD, No Lead 5 x 3 x 1.1mm Source: Datasheet <https://abracon.com/Resonators/abm3b.pdf>; DESCRIPTION: Abracon 8MHz Crystal +/-10ppm 4-SMD, No Lead 5 x 3 x 1.1mm; HEIGHT: mm; MANUFACTURER_NAME: ABRACON; MANUFACTURER_PART_NUMBER: ABM3B-8.000MHZ-10-1-U-T; MOUSER_PART_NUMBER: 815-ABM3B8MHZ101UT; MOUSER_PRICE-STOCK: https://www.mouser.co.uk/ProductDetail/ABRACON/ABM3B-8000MHZ-10-1-U-T?qs=axzvp2Rdp5%252B1td01iPkwcw%3D%3D